# EAGLE schematic tachstrip (EAGLE 7.4.0)
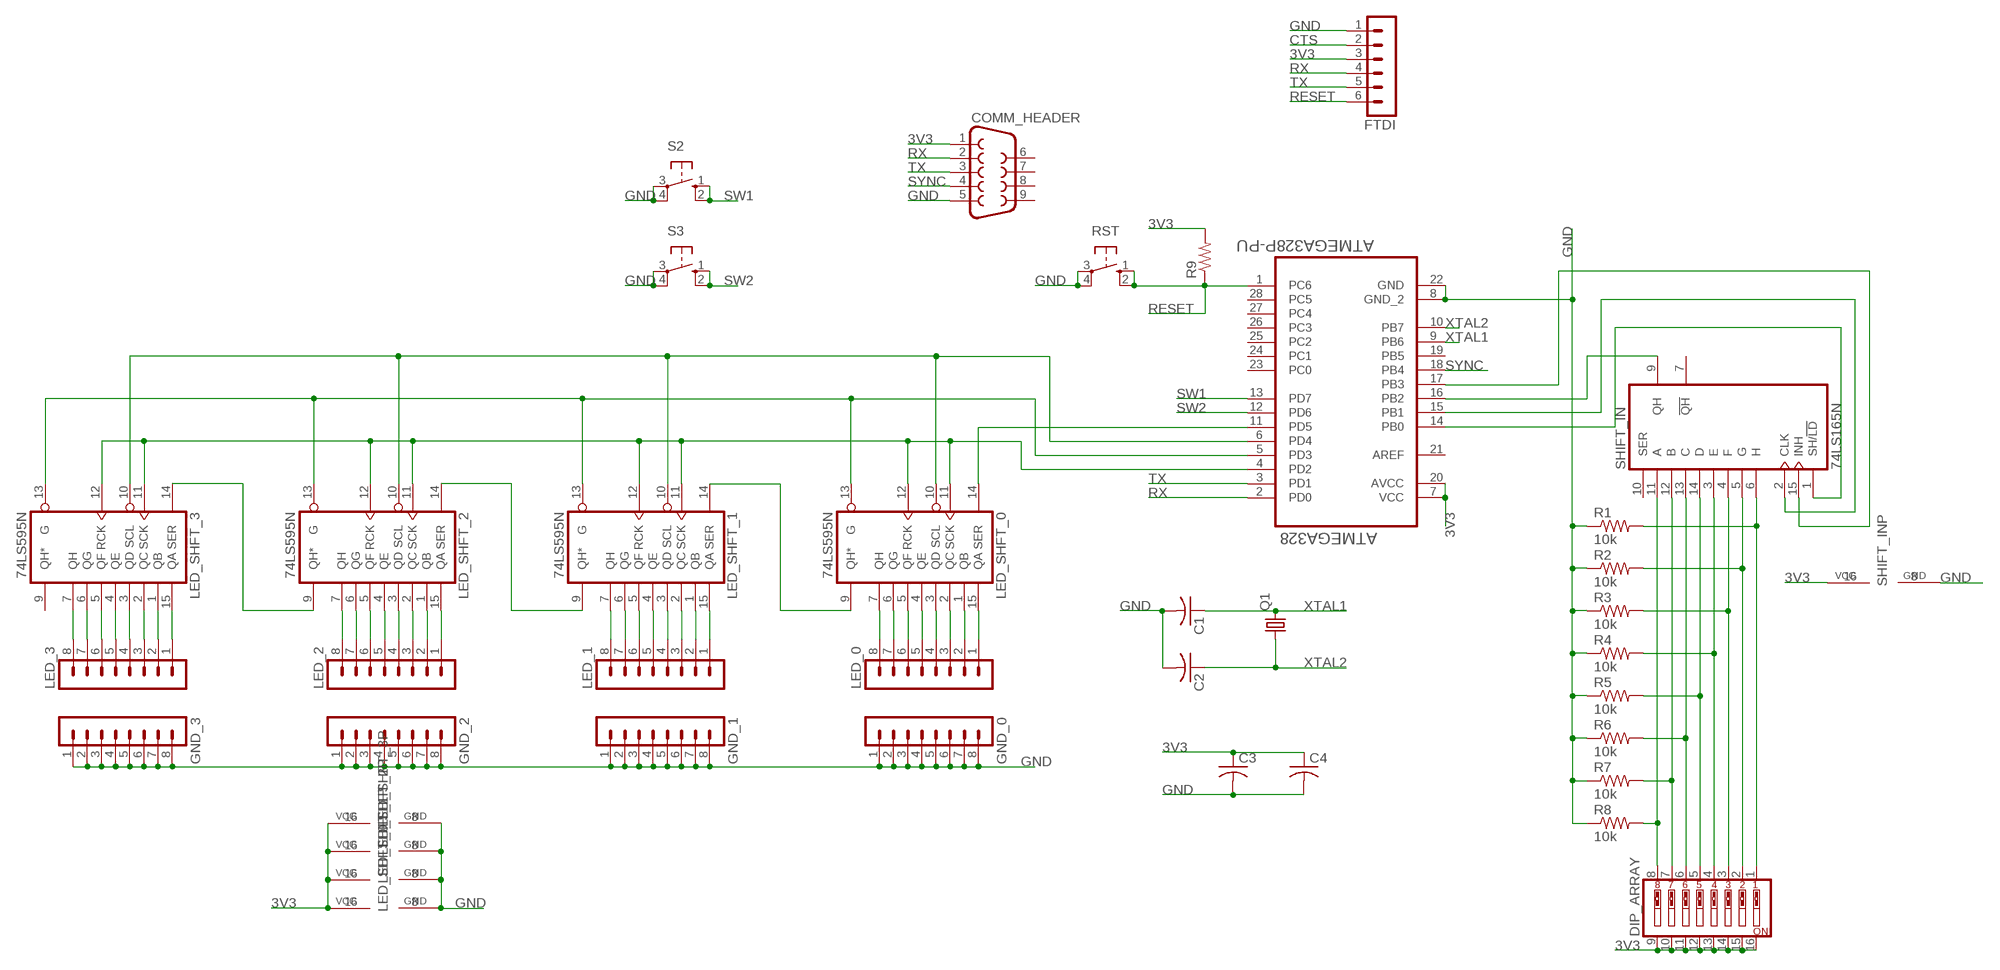
[diagram p0: schematic, sheet 1]

## Parts
ATMEGA328  ATMEGA328P-PU  [DIP254P762X457-28]
C1  C-US025-025X050  [C025-025X050]
C2  C-US025-025X050  [C025-025X050]
C3  C-US025-025X050  [C025-025X050]
C4  C-US025-025X050  [C025-025X050]
COMM_HEADER  F09VB  [F09VB]
DIP_ARRAY  SW_DIP-8  [DIPSWITCH-08]
FTDI  MA06-1  [MA06-1]
GND_0  MA08-1  [MA08-1]
GND_1  MA08-1  [MA08-1]
GND_2  MA08-1  [MA08-1]
GND_3  MA08-1  [MA08-1]
LED_0  MA08-1  [MA08-1]
LED_1  MA08-1  [MA08-1]
LED_2  MA08-1  [MA08-1]
LED_3  MA08-1  [MA08-1]
LED_SHFT_0  74LS595N  [DIL16]
LED_SHFT_1  74LS595N  [DIL16]
LED_SHFT_2  74LS595N  [DIL16]
LED_SHFT_3  74LS595N  [DIL16]
Q1  CRYSTALHC49S  [HC49/S]
R1  10k  R-US_0204/5  [0204/5]
R2  10k  R-US_0204/5  [0204/5]
R3  10k  R-US_0204/5  [0204/5]
R4  10k  R-US_0204/5  [0204/5]
R5  10k  R-US_0204/5  [0204/5]
R6  10k  R-US_0204/5  [0204/5]
R7  10k  R-US_0204/5  [0204/5]
R8  10k  R-US_0204/5  [0204/5]
R9  R-US_0204/7  [0204/7]
RST  10-XX  [B3F-10XX]
S2  10-XX  [B3F-10XX]
S3  10-XX  [B3F-10XX]
SHIFT_IN  74LS165N  [DIL16]

## Nets
3V3: ATMEGA328.7(VCC) ATMEGA328.20(AVCC) C3.1 C4.1 COMM_HEADER.1 DIP_ARRAY.9 DIP_ARRAY.10 DIP_ARRAY.11 DIP_ARRAY.12 DIP_ARRAY.13 DIP_ARRAY.14 DIP_ARRAY.15 DIP_ARRAY.16 FTDI.3 LED_SHFT_0.16(VCC) LED_SHFT_1.16(VCC) LED_SHFT_2.16(VCC) LED_SHFT_3.16(VCC) R9.2 SHIFT_IN.16(VCC)
CTS: FTDI.2
GND: ATMEGA328.8(GND_2) ATMEGA328.22(GND) C1.2 C2.2 C3.2 C4.2 COMM_HEADER.5 FTDI.1 GND_0.1 GND_0.2 GND_0.3 GND_0.4 GND_0.5 GND_0.6 GND_0.7 GND_0.8 GND_1.1 GND_1.2 GND_1.3 GND_1.4 GND_1.5 GND_1.6 GND_1.7 GND_1.8 GND_2.1 GND_2.2 GND_2.3 GND_2.4 GND_2.5 GND_2.6 GND_2.7 GND_2.8 GND_3.1 GND_3.2 GND_3.3 GND_3.4 GND_3.5 GND_3.6 GND_3.7 GND_3.8 LED_SHFT_0.8(GND) LED_SHFT_1.8(GND) LED_SHFT_2.8(GND) LED_SHFT_3.8(GND) R1.1 R2.1 R3.1 R4.1 R5.1 R6.1 R7.1 R8.1 RST.3(P) RST.4(P1) S2.3(P) S2.4(P1) S3.3(P) S3.4(P1) SHIFT_IN.8(GND)
N$3: LED_SHFT_1.9(QH*) LED_SHFT_2.14(SER)
N$4: LED_SHFT_2.9(QH*) LED_SHFT_3.14(SER)
N$5: LED_3.1 LED_SHFT_3.15(QA)
N$6: LED_3.2 LED_SHFT_3.1(QB)
N$7: LED_3.3 LED_SHFT_3.2(QC)
N$8: LED_3.4 LED_SHFT_3.3(QD)
N$9: LED_3.5 LED_SHFT_3.4(QE)
N$10: ATMEGA328.4(PD2) LED_SHFT_0.11(SCK) LED_SHFT_0.12(RCK) LED_SHFT_1.11(SCK) LED_SHFT_1.12(RCK) LED_SHFT_2.11(SCK) LED_SHFT_2.12(RCK) LED_SHFT_3.11(SCK) LED_SHFT_3.12(RCK)
N$11: ATMEGA328.5(PD3) LED_SHFT_0.13(G) LED_SHFT_1.13(G) LED_SHFT_2.13(G) LED_SHFT_3.13(G)
N$12: ATMEGA328.11(PD5) LED_SHFT_0.14(SER)
N$13: DIP_ARRAY.8 R8.2 SHIFT_IN.11(A)
N$14: DIP_ARRAY.7 R7.2 SHIFT_IN.12(B)
N$15: DIP_ARRAY.6 R6.2 SHIFT_IN.13(C)
N$16: DIP_ARRAY.5 R5.2 SHIFT_IN.14(D)
N$17: DIP_ARRAY.4 R4.2 SHIFT_IN.3(E)
N$18: DIP_ARRAY.3 R3.2 SHIFT_IN.4(F)
N$19: DIP_ARRAY.2 R2.2 SHIFT_IN.5(G)
N$20: DIP_ARRAY.1 R1.2 SHIFT_IN.6(H)
N$21: ATMEGA328.14(PB0) SHIFT_IN.1(SH/!LD)
N$22: ATMEGA328.15(PB1) SHIFT_IN.2(CLK)
N$23: ATMEGA328.16(PB2) SHIFT_IN.9(QH)
N$24: ATMEGA328.17(PB3) SHIFT_IN.15(INH)
N$25: LED_3.6 LED_SHFT_3.5(QF)
N$26: LED_3.7 LED_SHFT_3.6(QG)
N$27: LED_3.8 LED_SHFT_3.7(QH)
N$28: LED_2.8 LED_SHFT_2.7(QH)
N$29: LED_2.7 LED_SHFT_2.6(QG)
N$30: LED_2.6 LED_SHFT_2.5(QF)
N$31: LED_2.5 LED_SHFT_2.4(QE)
N$32: LED_2.4 LED_SHFT_2.3(QD)
N$33: LED_2.3 LED_SHFT_2.2(QC)
N$34: LED_2.2 LED_SHFT_2.1(QB)
N$35: LED_2.1 LED_SHFT_2.15(QA)
N$36: ATMEGA328.6(PD4) LED_SHFT_0.10(SCL) LED_SHFT_1.10(SCL) LED_SHFT_2.10(SCL) LED_SHFT_3.10(SCL)
N$37: LED_1.8 LED_SHFT_1.7(QH)
N$38: LED_SHFT_0.9(QH*) LED_SHFT_1.14(SER)
N$39: LED_1.7 LED_SHFT_1.6(QG)
N$40: LED_1.6 LED_SHFT_1.5(QF)
N$41: LED_1.5 LED_SHFT_1.4(QE)
N$42: LED_1.4 LED_SHFT_1.3(QD)
N$43: LED_1.3 LED_SHFT_1.2(QC)
N$44: LED_1.2 LED_SHFT_1.1(QB)
N$45: LED_1.1 LED_SHFT_1.15(QA)
N$46: LED_0.8 LED_SHFT_0.7(QH)
N$47: LED_0.7 LED_SHFT_0.6(QG)
N$48: LED_0.6 LED_SHFT_0.5(QF)
N$49: LED_0.5 LED_SHFT_0.4(QE)
N$50: LED_0.4 LED_SHFT_0.3(QD)
N$51: LED_0.3 LED_SHFT_0.2(QC)
N$52: LED_0.2 LED_SHFT_0.1(QB)
N$53: LED_0.1 LED_SHFT_0.15(QA)
RESET: ATMEGA328.1(PC6) FTDI.6 R9.1 RST.1(S) RST.2(S1)
RX: ATMEGA328.2(PD0) COMM_HEADER.2 FTDI.4
SW1: ATMEGA328.13(PD7) S2.1(S) S2.2(S1)
SW2: ATMEGA328.12(PD6) S3.1(S) S3.2(S1)
SYNC: ATMEGA328.18(PB4) COMM_HEADER.4
TX: ATMEGA328.3(PD1) COMM_HEADER.3 FTDI.5
XTAL1: ATMEGA328.9(PB6) C1.1 Q1.2
XTAL2: ATMEGA328.10(PB7) C2.1 Q1.1
Unconnected: ATMEGA328.19(PB5) ATMEGA328.21(AREF) ATMEGA328.23(PC0) ATMEGA328.24(PC1) ATMEGA328.25(PC2) ATMEGA328.26(PC3) ATMEGA328.27(PC4) ATMEGA328.28(PC5) COMM_HEADER.6 COMM_HEADER.7 COMM_HEADER.8 COMM_HEADER.9 LED_SHFT_3.9(QH*) SHIFT_IN.7(!QH) SHIFT_IN.10(SER)

## Library data of the parts
ATMEGA328 = Atmel_By_element14_Batch_1-00:ATMEGA328P-PU: 8-bit Microcontroller with In-System Programmable Flash; MPN: ATMEGA328P-PU; OC_FARNELL: 1715487; OC_NEWARK: 15R0268; PACKAGE: PDIP-28; SUPPLIER: Atmel
C1-C4 = rcl:C-US: CAPACITOR, American symbol
COMM_HEADER = con-subd:F09: SUB-D; OC_FARNELL: unknown; OC_NEWARK: unknown
DIP_ARRAY = SparkFun-Electromechanical:SW_DIP-8: DIP Switch 8 Position
FTDI = con-lstb:MA06-1: PIN HEADER; OC_FARNELL: unknown; OC_NEWARK: unknown
GND_0 GND_1-GND_3 LED_0 LED_1-LED_3 = con-lstb:MA08-1: PIN HEADER; OC_FARNELL: unknown; OC_NEWARK: unknown
LED_SHFT_0 LED_SHFT_1-LED_SHFT_3 = 74xx-us:74*595: 8-bit SHIFT REGISTER, output latch
Q1 = crystal:CRYSTAL: CRYSTAL; OC_FARNELL: 1667008; OC_NEWARK: unknown
R1-R8 = resistor:R-US_: RESISTOR, American symbol
R9 = rcl:R-US_: RESISTOR, American symbol
RST S2 S3 = switch-omron:10-XX: OMRON SWITCH; MPN: B3F-1000; OC_FARNELL: 176432; OC_NEWARK: 36M3542
SHIFT_IN = 74xx-us:74*165: 8-bit parallel load SHIFT REGISTER